# EAGLE schematic Vorlage ATmega644PA (EAGLE 9.4.2)
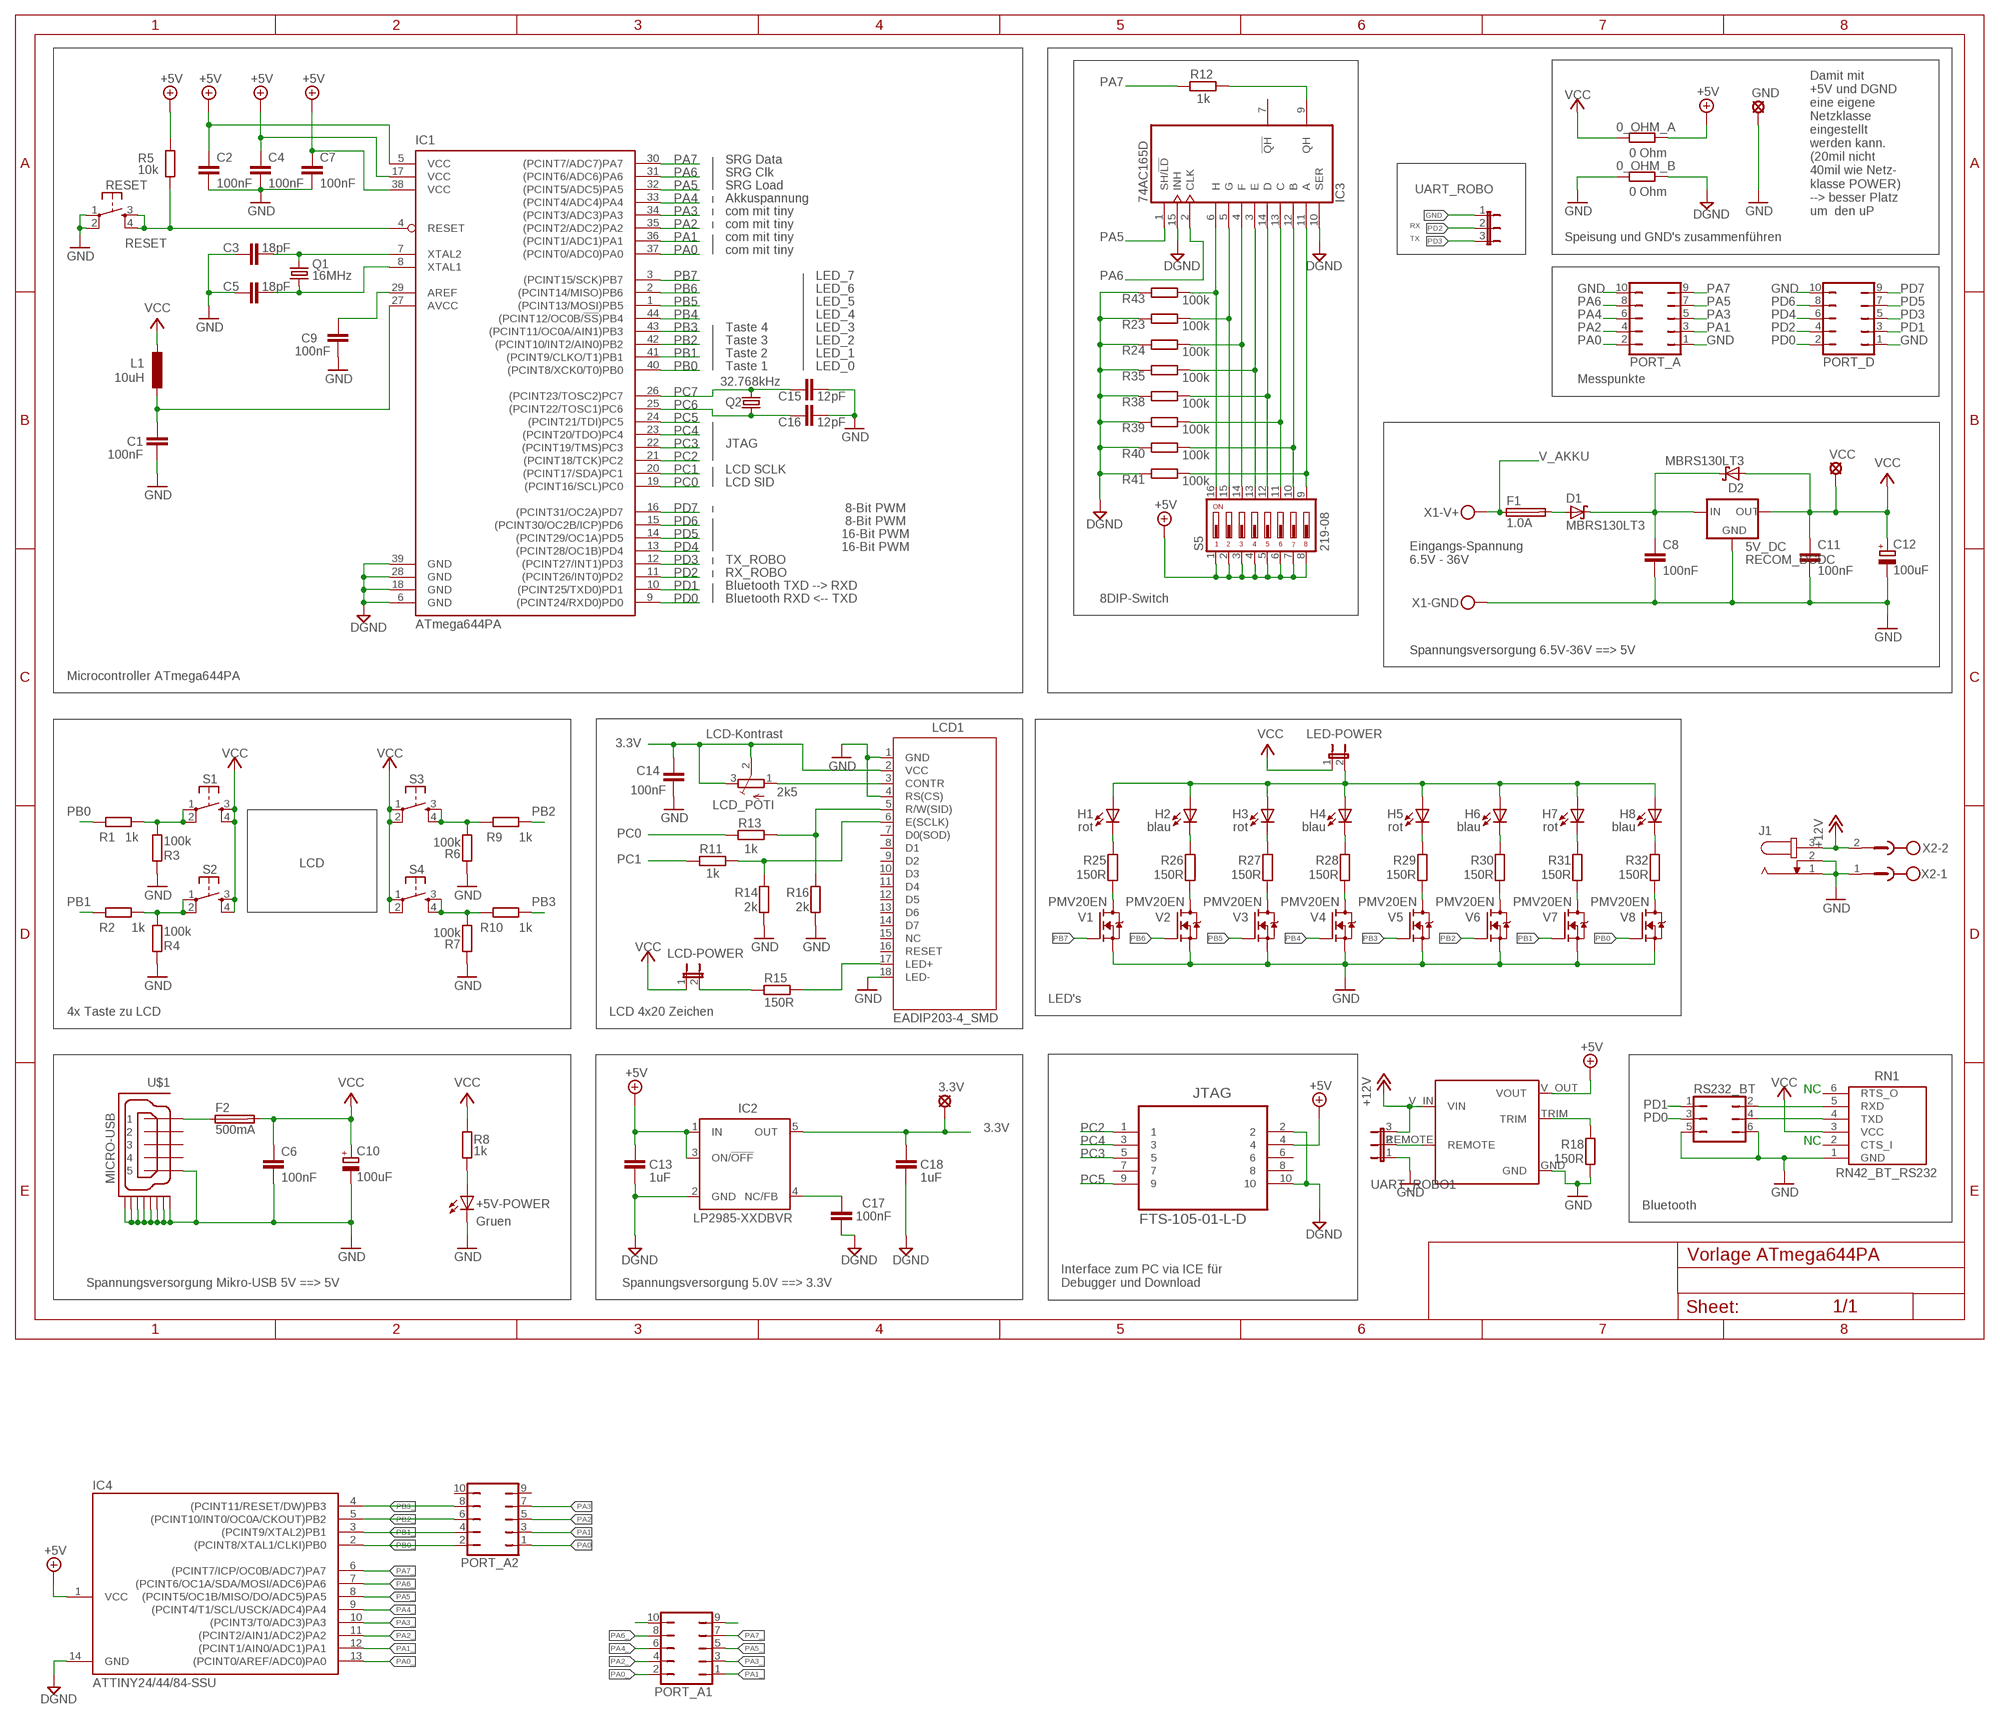
[diagram p0: schematic, sheet 1]

## Parts
0_OHM_A  0 Ohm  R-EU_R0805  [R0805]
0_OHM_B  0 Ohm  R-EU_R0805  [R0805]
3.3V  3.3V  LSP11  [LSP11]
5V_DC  RECOM_DCDC  [RECOM_DCDC]
+5V-POWER  Gruen  LEDCHIPLED_1206  [CHIPLED_1206]
C1  100nF  C-EUC0805  [C0805]
C2  100nF  C-EUC1206  [C1206]
C3  18pF  C-EUC0805  [C0805]
C4  100nF  C-EUC1206  [C1206]
C5  18pF  C-EUC0805  [C0805]
C6  100nF  C-EUC1206  [C1206]
C7  100nF  C-EUC0805  [C0805]
C8  100nF  C-EUC0805  [C0805]
C9  100nF  C-EUC0805  [C0805]
C10  100uF  CPOL-EUUD-6,3X8,8  [UD-6,3X5,8_NICHICON]
C11  100nF  C-EUC0805  [C0805]
C12  100uF  CPOL-EUUD-6,3X8,8  [UD-6,3X5,8_NICHICON]
C13  1uF  C-EUC0805  [C0805]
C14  100nF  C-EUC0805  [C0805]
C15  12pF  C-EUC0805  [C0805]
C16  12pF  C-EUC0805K  [C0805K]
C17  100nF  C-EUC0805  [C0805]
C18  1uF  C-EUC0805  [C0805]
D1  MBRS130LT3  [SMB]
D2  MBRS130LT3  [SMB]
F1  1.0A  195601206  [F1206]
F2  500mA  195601206  [F1206]
GND  3.3V  LSP11  [LSP11]
H1  rot  LEDCHIPLED_1206  [CHIPLED_1206]
H2  blau  LEDCHIPLED_1206  [CHIPLED_1206]
H3  rot  LEDCHIPLED_1206  [CHIPLED_1206]
H4  blau  LEDCHIPLED_1206  [CHIPLED_1206]
H5  rot  LEDCHIPLED_1206  [CHIPLED_1206]
H6  blau  LEDCHIPLED_1206  [CHIPLED_1206]
H7  rot  LEDCHIPLED_1206  [CHIPLED_1206]
H8  blau  LEDCHIPLED_1206  [CHIPLED_1206]
IC1  ATmega644PA  ATMEGA644A  [TQFP44]
IC2  LP2985-XXDBVR  [SOT23-DBV]
IC3  74AC165D  [SO16]
IC4  ATTINY24/44/84-SSU  [SOIC14]
J1  JACK-PLUG0  [SPC4077]
JTAG  FTS-105-01-L-D  [SAMTEC_FTS-105-01-L-D]
L1  10uH  L-EUL2825P  [L2825P]
LCD1  EADIP203-4_SMD  EADIP203-4EADIP203-4SMD  [EADIP203-4SMD]
LCD-POWER  JP1E  [JP1]
LCD_POTI  2k5  TRIM_EU-3223G  [3223G]
LED-POWER  JP1E  [JP1]
PORT_A  JP5Q  [JP5Q]
PORT_A1  JP5Q  [JP5Q]
PORT_A2  JP5Q  [JP5Q]
PORT_D  JP5Q  [JP5Q]
Q1  16MHz  CRYSTALHC49UP  [HC49UP]
Q2  32.768kHz  CRYSTALTC38H  [TC38H]
R1  1k  R-EU_R0805  [R0805]
R2  1k  R-EU_R0805  [R0805]
R3  100k  R-EU_R0805  [R0805]
R4  100k  R-EU_R0805  [R0805]
R5  10k  R-EU_R0805  [R0805]
R6  100k  R-EU_R0805  [R0805]
R7  100k  R-EU_R0805  [R0805]
R8  1k  R-EU_R0805  [R0805]
R9  1k  R-EU_R0805  [R0805]
R10  1k  R-EU_R0805  [R0805]
R11  1k  R-EU_R0805  [R0805]
R12  1k  R-EU_R1206  [R1206]
R13  1k  R-EU_R0805  [R0805]
R14  2k  R-EU_R0805  [R0805]
R15  150R  R-EU_R1206  [R1206]
R16  2k  R-EU_R0805  [R0805]
R18  150R  R-EU_R0805  [R0805]
R23  100k  R-EU_R0805  [R0805]
R24  100k  R-EU_R0805  [R0805]
R25  150R  R-EU_R0805  [R0805]
R26  150R  R-EU_R0805  [R0805]
R27  150R  R-EU_R0805  [R0805]
R28  150R  R-EU_R0805  [R0805]
R29  150R  R-EU_R0805  [R0805]
R30  150R  R-EU_R0805  [R0805]
R31  150R  R-EU_R0805  [R0805]
R32  150R  R-EU_R0805  [R0805]
R35  100k  R-EU_R0805  [R0805]
R38  100k  R-EU_R0805  [R0805]
R39  100k  R-EU_R0805  [R0805]
R40  100k  R-EU_R0805  [R0805]
R41  100k  R-EU_R0805  [R0805]
R43  100k  R-EU_R0805  [R0805]
RESET  TS42_4PAD  [TS42_4PAD]
RN1  RN42_BT_RS232  [RN42BT_RS232]
RS232_BT  JP3Q  [JP3Q]
S1  TS42_4PAD  [TS42_4PAD]
S2  TS42_4PAD  [TS42_4PAD]
S3  TS42_4PAD  [TS42_4PAD]
S4  TS42_4PAD  [TS42_4PAD]
S5  219-08  [CTS-219-08]
U$1  MICRO-USB  MICRO-USB-RECEPTACLE47589-0001  [47589-0001]
U$3  DCDC  [1X2,3_2.54MM]
UART_ROBO  JP2E  [JP2]
UART_ROBO1  JP2E  [JP2]
V1  PMV20EN  BSS138  [SOT23]
V2  PMV20EN  BSS138  [SOT23]
V3  PMV20EN  BSS138  [SOT23]
V4  PMV20EN  BSS138  [SOT23]
V5  PMV20EN  BSS138  [SOT23]
V6  PMV20EN  BSS138  [SOT23]
V7  PMV20EN  BSS138  [SOT23]
V8  PMV20EN  BSS138  [SOT23]
VCC  3.3V  LSP11  [LSP11]
X1  MKDSN1,5/2-5,08  [MKDSN1,5/2-5,08]
X2  MSTBV2  [MSTBV2]

## Nets
3.3V: 3.3V.MP C14.1 C18.1 IC2.5(OUT) LCD1.2(VCC) LCD_POTI.2(S) LCD_POTI.3(E)
+5V: 0_OHM_A.2 C2.1 C4.1 C7.1 C13.1 IC1.5(VCC) IC1.17(VCC) IC1.38(VCC) IC2.1(IN) IC2.3(ON/!OFF) IC4.1(VCC) JTAG.4 R5.2 S5.1 S5.2 S5.3 S5.4 S5.5 S5.6 S5.7 S5.8 U$3.V_OUT(VOUT)
+12V: J1.3 U$3.V_IN(VIN) UART_ROBO1.3 X2.2
DGND: 0_OHM_B.2 C13.2 C17.2 C18.2 IC1.6(GND) IC1.18(GND) IC1.28(GND) IC1.39(GND) IC2.2(GND) IC3.10(SER) IC3.15(INH) IC4.14(GND) JTAG.2 JTAG.10 R23.2 R24.2 R35.2 R38.2 R39.2 R40.2 R41.2 R43.2
GND [POWER]: 0_OHM_B.1 5V_DC.GND +5V-POWER.C C1.1 C2.2 C3.1 C4.2 C5.2 C6.2 C7.2 C8.2 C9.1 C10.- C11.2 C12.- C14.2 C15.2 C16.2 GND.MP J1.1 J1.2 LCD1.1(GND) LCD1.4(RS(CS)) LCD1.18(LED-) PORT_A.1 PORT_A.10 PORT_D.1 PORT_D.10 R3.1 R4.1 R6.2 R7.2 R14.1 R16.1 R18.1 RESET.1 RESET.2 RN1.1(GND) RS232_BT.5 RS232_BT.6 U$1.5 U$1.CASING1(GND1) U$1.CASING2(GND2) U$1.CASING3(GND3) U$1.CASING4(GND4) U$1.CASING5(GND5) U$1.CASING6(GND6) U$1.CASING7(GND7) U$1.CASING8(GND8) U$3.GND UART_ROBO1.1 UART_ROBO.1 V1.2(S) V2.2(S) V3.2(S) V4.2(S) V5.2(S) V6.2(S) V7.2(S) V8.2(S) X1.1.1 X1.1.2 X2.1
N$3: F2.1 U$1.1
N$4: U$3.REMOTE UART_ROBO1.2
N$5: H2.C R26.2
N$6: H1.C R25.2
N$7: R25.1 V1.3(D)
N$8: R26.1 V2.3(D)
N$9 [POWER]: D1.A F1.2
N$12: LCD-POWER.2 R15.2
N$13: H1.A H2.A H3.A H4.A H5.A H6.A H7.A H8.A LED-POWER.2
N$14: RN1.5(RXD) RS232_BT.2
N$15: RN1.4(TXD) RS232_BT.4
N$16: R18.2 U$3.TRIM
N$17: IC3.6(H) R43.1 S5.16
N$18: IC3.5(G) R23.1 S5.15
N$21: R1.2 R3.2 S1.1 S1.2
N$22: R2.2 R4.2 S2.1 S2.2
N$23: R7.1 R10.1 S4.3 S4.4
N$24: R6.1 R9.1 S3.3 S3.4
N$25: H4.C R28.2
N$26: H3.C R27.2
N$27: PORT_A1.9
N$28: PORT_A1.10
N$30: R27.1 V3.3(D)
N$31: IC3.4(F) R24.1 S5.14
N$32: R28.1 V4.3(D)
N$34: LCD1.3(CONTR) LCD_POTI.1(A)
N$35: C1.2 IC1.27(AVCC) L1.2
N$36: C5.1 IC1.8(XTAL1) Q1.1
N$37: C3.2 IC1.7(XTAL2) Q1.2
N$38: C9.2 IC1.29(AREF)
N$39: LCD1.6(E(SCLK)) R11.1 R14.2
N$40: LCD1.5(R/W(SID)) R13.1 R16.2
N$42: H6.C R30.2
N$43: H5.C R29.2
N$44: R29.1 V5.3(D)
N$45: R30.1 V6.3(D)
N$48: H8.C R32.2
N$49: H7.C R31.2
N$50: R31.1 V7.3(D)
N$51: R32.1 V8.3(D)
N$59: IC3.3(E) R35.1 S5.13
N$60: +5V-POWER.A R8.1
N$61: IC3.14(D) R38.1 S5.12
N$62: IC3.13(C) R39.1 S5.11
N$63: IC3.12(B) R40.1 S5.10
N$64: IC3.11(A) R41.1 S5.9
N$66: IC3.9(QH) R12.1
N$70: C17.1 IC2.4(NC/FB)
N$75 [POWER]: 5V_DC.IN C8.1 D1.C D2.C
N$95: LCD1.17(LED+) R15.1
PA0: IC1.37((PCINT0/ADC0)PA0) PORT_A2.1 PORT_A.2
PA0_: IC4.13((PCINT0/AREF/ADC0)PA0) PORT_A1.2
PA1: IC1.36((PCINT1/ADC1)PA1) PORT_A2.3 PORT_A.3
PA1_: IC4.12((PCINT1/AIN0/ADC1)PA1) PORT_A1.1
PA2: IC1.35((PCINT2/ADC2)PA2) PORT_A2.5 PORT_A.4
PA2_: IC4.11((PCINT2/AIN1/ADC2)PA2) PORT_A1.4
PA3: IC1.34((PCINT3/ADC3)PA3) PORT_A2.7 PORT_A.5
PA3_: IC4.10((PCINT3/T0/ADC3)PA3) PORT_A1.3
PA4: IC1.33((PCINT4/ADC4)PA4) PORT_A.6
PA4_: IC4.9((PCINT4/T1/SCL/USCK/ADC4)PA4) PORT_A1.6
PA5: IC1.32((PCINT5/ADC5)PA5) IC3.1(SH/!LD) PORT_A.7
PA5_: IC4.8((PCINT5/OC1B/MISO/DO/ADC5)PA5) PORT_A1.5
PA6: IC1.31((PCINT6/ADC6)PA6) IC3.2(CLK) PORT_A.8
PA6_: IC4.7((PCINT6/OC1A/SDA/MOSI/ADC6)PA6) PORT_A1.8
PA7: IC1.30((PCINT7/ADC7)PA7) PORT_A.9 R12.2
PA7_: IC4.6((PCINT7/ICP/OC0B/ADC7)PA7) PORT_A1.7
PB0: IC1.40((PCINT8/XCK0/T0)PB0) R1.1 V8.1(G)
PB0_: IC4.2((PCINT8/XTAL1/CLKI)PB0) PORT_A2.2
PB1: IC1.41((PCINT9/CLKO/T1)PB1) R2.1 V7.1(G)
PB1_: IC4.3((PCINT9/XTAL2)PB1) PORT_A2.4
PB2: IC1.42((PCINT10/INT2/AIN0)PB2) R9.2 V6.1(G)
PB2_: IC4.5((PCINT10/INT0/OC0A/CKOUT)PB2) PORT_A2.6
PB3: IC1.43((PCINT11/OC0A/AIN1)PB3) R10.2 V5.1(G)
PB3_: IC4.4((PCINT11/RESET/DW)PB3) PORT_A2.8
PB4: IC1.44((PCINT12/OC0B/!SS!)PB4) V4.1(G)
PB5: IC1.1((PCINT13/MOSI)PB5) V3.1(G)
PB6: IC1.2((PCINT14/MISO)PB6) V2.1(G)
PB7: IC1.3((PCINT15/SCK)PB7) V1.1(G)
PC0: IC1.19((PCINT16/SCL)PC0) R13.2
PC1: IC1.20((PCINT17/SDA)PC1) R11.2
PC2: IC1.21((PCINT18/TCK)PC2) JTAG.1
PC3: IC1.22((PCINT19/TMS)PC3) JTAG.5
PC4: IC1.23((PCINT20/TDO)PC4) JTAG.3
PC5: IC1.24((PCINT21/TDI)PC5) JTAG.9
PC6: C16.1 IC1.25((PCINT22/TOSC1)PC6) Q2.2
PC7: C15.1 IC1.26((PCINT23/TOSC2)PC7) Q2.1
PD0: IC1.9((PCINT24/RXD0)PD0) PORT_D.2 RS232_BT.3
PD1: IC1.10((PCINT25/TXD0)PD1) PORT_D.3 RS232_BT.1
PD2: IC1.11((PCINT26/INT0)PD2) PORT_D.4 UART_ROBO.2
PD3: IC1.12((PCINT27/INT1)PD3) PORT_D.5 UART_ROBO.3
PD4: IC1.13((PCINT28/OC1B)PD4) PORT_D.6
PD5: IC1.14((PCINT29/OC1A)PD5) PORT_D.7
PD6: IC1.15((PCINT30/OC2B/ICP)PD6) PORT_D.8
PD7: IC1.16((PCINT31/OC2A)PD7) PORT_D.9
RESET: IC1.4(RESET) R5.1 RESET.3 RESET.4
V_AKKU [POWER]: F1.1 X1.2.1 X1.2.2
VCC [POWER]: 0_OHM_A.1 5V_DC.OUT C6.1 C10.+ C11.1 C12.+ D2.A F2.2 L1.1 LCD-POWER.1 LED-POWER.1 R8.2 RN1.3(VCC) S1.3 S1.4 S2.3 S2.4 S3.1 S3.2 S4.1 S4.2 VCC.MP
Unconnected: IC3.7(!QH) JTAG.6 JTAG.7 JTAG.8 LCD1.7(D0(SOD)) LCD1.8(D1) LCD1.9(D2) LCD1.10(D3) LCD1.11(D4) LCD1.12(D5) LCD1.13(D6) LCD1.14(D7) LCD1.15(NC) LCD1.16(RESET) PORT_A2.9 PORT_A2.10 RN1.2(CTS_I) RN1.6(RTS_O) U$1.2 U$1.3 U$1.4

## Notes on the sheet
- SRG Data
- SRG Clk
- SRG Load
- Akkuspannung
- com mit tiny
- Damit mit
  +5V und DGND
  eine eigene 
  Netzklasse
  eingestellt
  werden kann.
  (20mil nicht
  40mil wie Netz-
  klasse POWER)
  --> besser Platz 
  um  den uP
- com mit tiny | RX
- com mit tiny | TX | Speisung und GND's zusammenführen
- com mit tiny
- LED_7
- LED_6
- LED_5
- LED_4
- Taste 4 | LED_3
- Taste 3 | LED_2
- Taste 2 | LED_1
- Taste 1 | LED_0
- Messpunkte
- JTAG
- LCD SCLK
- LCD SID
- 8-Bit PWM
- 8-Bit PWM
- 16-Bit PWM
- 16-Bit PWM
- TX_ROBO
- Eingangs-Spannung
  6.5V - 36V
- RX_ROBO
- Bluetooth TXD --> RXD
- Bluetooth RXD <-- TXD | 8DIP-Switch
- Spannungsversorgung 6.5V-36V ==> 5V
- Microcontroller ATmega644PA
- LCD-Kontrast
- LCD
- LED's
- 4x Taste zu LCD | LCD 4x20 Zeichen
- NC
- NC
- Bluetooth
- Spannungsversorgung Mikro-USB 5V ==> 5V | Spannungsversorgung 5.0V ==> 3.3V
- Interface zum PC via ICE für
  Debugger und Download

## Power pins joined to a net without a drawn wire
GND: IC3.8(GND)
VCC: IC3.16(VCC)

## Library data of the parts
0_OHM_A 0_OHM_B R1-R11 R13 R14 R16 R18 R23-R32 R35 R38-R41 R43 = rcl:R-EU_: RESISTOR, European symbol; SPICEPREFIX: R
3.3V GND VCC = solpad:LSP11: SOLDER PAD drill 1.1 mm
5V_DC = DCDC:RECOM_DCDC
+5V-POWER H1-H8 = led:LED: LED OSRAM: - CHIPLED LG R971, LG N971, LY N971, LG Q971, LY Q971, LO R971, LY R971 LH N974, LH R974 LS Q976, LO Q976, LY Q976 LO Q996 - Hyper CHIPLED LW Q18S LB Q993, LB Q99A, LB R99A - SideLED LS A670, LO A670, LY A670, LG A670, LP A670 LB A673, LV A673, LT A673, LW A673 LH A674 LY A675 LS A676, LA A676, LO A676, LY A676, LW A676 LS A679, LY A679, LG A679 - Hyper Micro SIDELED® LS Y876, LA Y876, LO Y876, LY Y876 LT Y87S - SmartLED LW L88C, LW L88S LB L89C, LB L89S, LG L890 LS L89K, LO L89K, LY L89K LS L896, LA L896, LO L896, LY L896 - TOPLED LS T670, LO T670, LY T670, LG T670, LP T670 LSG T670, LSP T670, LSY T670, LOP T670, LYG T670 LG T671, LOG T671, LSG T671 LB T673, LV T673, LT T673, LW T673 LH T674 LS T676, LA T676, LO T676, LY T676, LB T676, LH T676, LSB T676, LW T676 LB T67C, LV T67C, LT T67C, LS T67K, LO T67K, LY T67K, LW E67C LS E67B, LA E67B, LO E67B, LY E67B, LB E67C, LV E67C, LT E67C LW T67C LS T679, LY T679, LG T679 LS T770, LO T770, LY T770, LG T770, LP T770 LB T773, LV T773, LT T773, LW T773 LH T774 LS E675, LA E675, LY E675, LS T675 LS T776, LA T776, LO T776, LY T776, LB T776 LHGB T686 LT T68C, LB T68C - Hyper Mini TOPLED® LB M676 - Mini TOPLED Santana® LG M470 LS M47K, LO M47K, LY M47K Source: http://www.osram.convergy.de LUXEON: - LUMILED® LXK2-PW12-R00, LXK2-PW12-S00, LXK2-PW14-U00, LXK2-PW14-V00 LXK2-PM12-R00, LXK2-PM12-S00, LXK2-PM14-U00 LXK2-PE12-Q00, LXK2-PE12-R00, LXK2-PE12-S00, LXK2-PE14-T00, LXK2-PE14-U00 LXK2-PB12-K00, LXK2-PB12-L00, LXK2-PB12-M00, LXK2-PB14-N00, LXK2-PB14-P00, LXK2-PB14-Q00 LXK2-PR12-L00, LXK2-PR12-M00, LXK2-PR14-Q00, LXK2-PR14-R00 LXK2-PD12-Q00, LXK2-PD12-R00, LXK2-PD12-S00 LXK2-PH12-R00, LXK2-PH12-S00 LXK2-PL12-P00, LXK2-PL12-Q00, LXK2-PL12-R00 Source: www.luxeon.com KINGBRIGHT: KA-3528ASYC Source: www.kingbright.com
C1 C3 C5 C7-C9 C11 C13-C15 C17 C18 = rcl:C-EU: CAPACITOR, European symbol; SPICEPREFIX: C
C2 C4 C6 C16 = rcl:C-EU: CAPACITOR, European symbol
C10 C12 = rcl2:CPOL-EU: POLARIZED CAPACITOR, European symbol
D1 D2 = diode:MBRS130LT3: Schottky Power Rectifier Source: http://www.onsemi.com/pub/Collateral/MBRS130LT3-D.PDF
F1 F2 = fuse:19560: FUSE HOLDER TR5, Wickmann
IC1 = atmel:ATMEGA644: 8-bit Microcontroller with 64K Bytes In-System Programmable Flash Source: http://www.atmel.com/dyn/resources/prod_documents/doc2593.pdf; MPN: ATMEGA644PV-10AU; OC_FARNELL: 1455123; OC_NEWARK: 58M3748
IC2 = SmartPrj:LP2985-XXDBVR: ULTRALOW-POWER 50-mA LOW-DROPOUT LINEAR REGULATORS 50-mA Low-Dropout Regulator Source: http://focus.ti.com/lit/ds/symlink/tps77001.pdf
IC3 = 74xx-eu:74*165: 8-bit parallel load SHIFT REGISTER
IC4 = attiny24_44_84:ATTINY24/44/84
J1 = con-jack:JACK-PLUG: DC POWER JACK Power Jack, DC, Right Angle, Through Hole, Rated 5A at 16VDC, PC Terminals Distributor: Farnell (www.Farnell.de) Drawing: 84N1161.pdf / 84N1162.pdf Manufacturer: SPC Technology (www.spctechnology.com) Type: SPC4077 / SPC 4078; OC_FARNELL: unknown; OC_NEWARK: unknown
JTAG = JTAG_10pol_50mil:FTS-105-01-L-D; DESCRIPTION: CONN HEADER, 1.27MM, THRU HOLE, 10WAY; MPN: FTS-105-01-L-D; OCFARNELL: 1667728; OCNEWARK: 11P4652; PACKAGE: HEADER, 1.27MM, THRU HOLE, 10WAY; SUPPLIER: Samtec
L1 = rcl:L-EU: INDUCTOR, European symbol
LCD1 = display-lcd:EADIP203-4
LCD-POWER LED-POWER = jumper:JP1E: JUMPER
LCD_POTI = pot:TRIM_EU-: POTENTIOMETER
PORT_A PORT_A1 PORT_A2 PORT_D = jumper:JP5Q: JUMPER
Q1 Q2 = crystal:CRYSTAL: CRYSTAL; OC_FARNELL: unknown; OC_NEWARK: unknown
R12 R15 = rcl:R-EU_: RESISTOR, European symbol
RESET S1-S4 = SmartPrj:TS42_4PAD
RN1 = RN42_BT_RS232:RN42_BT_RS232
RS232_BT = jumper:JP3Q: JUMPER
S5 = switch-dil:219-08*: Surface Mount DIP Switch Series 219 SMT CTS Electronic Components Sourc: www.ctscorp.com; OC_FARNELL: unknown; OC_NEWARK: unknown
U$1 = con-molex-usb:MICRO-USB-RECEPTACLE: MICRO USB RECEPTACLES Micro-USB Receptacles, SMT, Lead-Free from MOLEX <http://www.molex.com/>. (C) 2014 Tomasz Boleslaw CEDRO, cederom@tlen.pl, http://www.tomek.cedro.info. Version 0.1 (2014-01-17): Initial release. Version 0.2 (2014-02-06): Updated 47589-0001 footprint pins/pads/milling. Following devices are included: 1. 47589-0001 Micro-USB AB Receptacle, Bottom Mount, SMT, Lead-Free <http://www.molex.com/molex/products/datasheet.jsp?part=active/0475890001_IO_CONNECTORS.xml> (Technical Drawing <http://www.molex.com/pdm_docs/sd/475890001_sd.pdf>).
U$3 = untitled:DCDC
UART_ROBO UART_ROBO1 = jumper:JP2E: JUMPER
V1-V8 = transistor-fet-mit-BSS138:BSS138
X1 = con_sirius:MKDSN1,5/2-5,08: MKDSN 1,5/ 2-5,08 Printklemme Nennstrom: 13,5 A Nennspannung: 250 V Rastermaß: 5,08 mm Polzahl: 2 Anschlussart: Schraubanschluss Montage: Löten Anschlussrichtung Leiter/Platine: 0 ° Artikelnummer: 1729128 Source: http://eshop.phoenixcontact.com .. 1729128.pdf; MPN: MKDSN 1,5/2-5.08; OC_FARNELL: 1792903; OC_NEWARK: 30M2397
X2 = con-phoenix-500:MSTBV2: PHOENIX; OC_FARNELL: unknown; OC_NEWARK: unknown

## Net classes
0 default: width 0.508 mm, drill 0.508 mm
1 POWER: width 1.016 mm, drill 1.016 mm